# EAGLE design Controller Board (EAGLE 9.6.2)
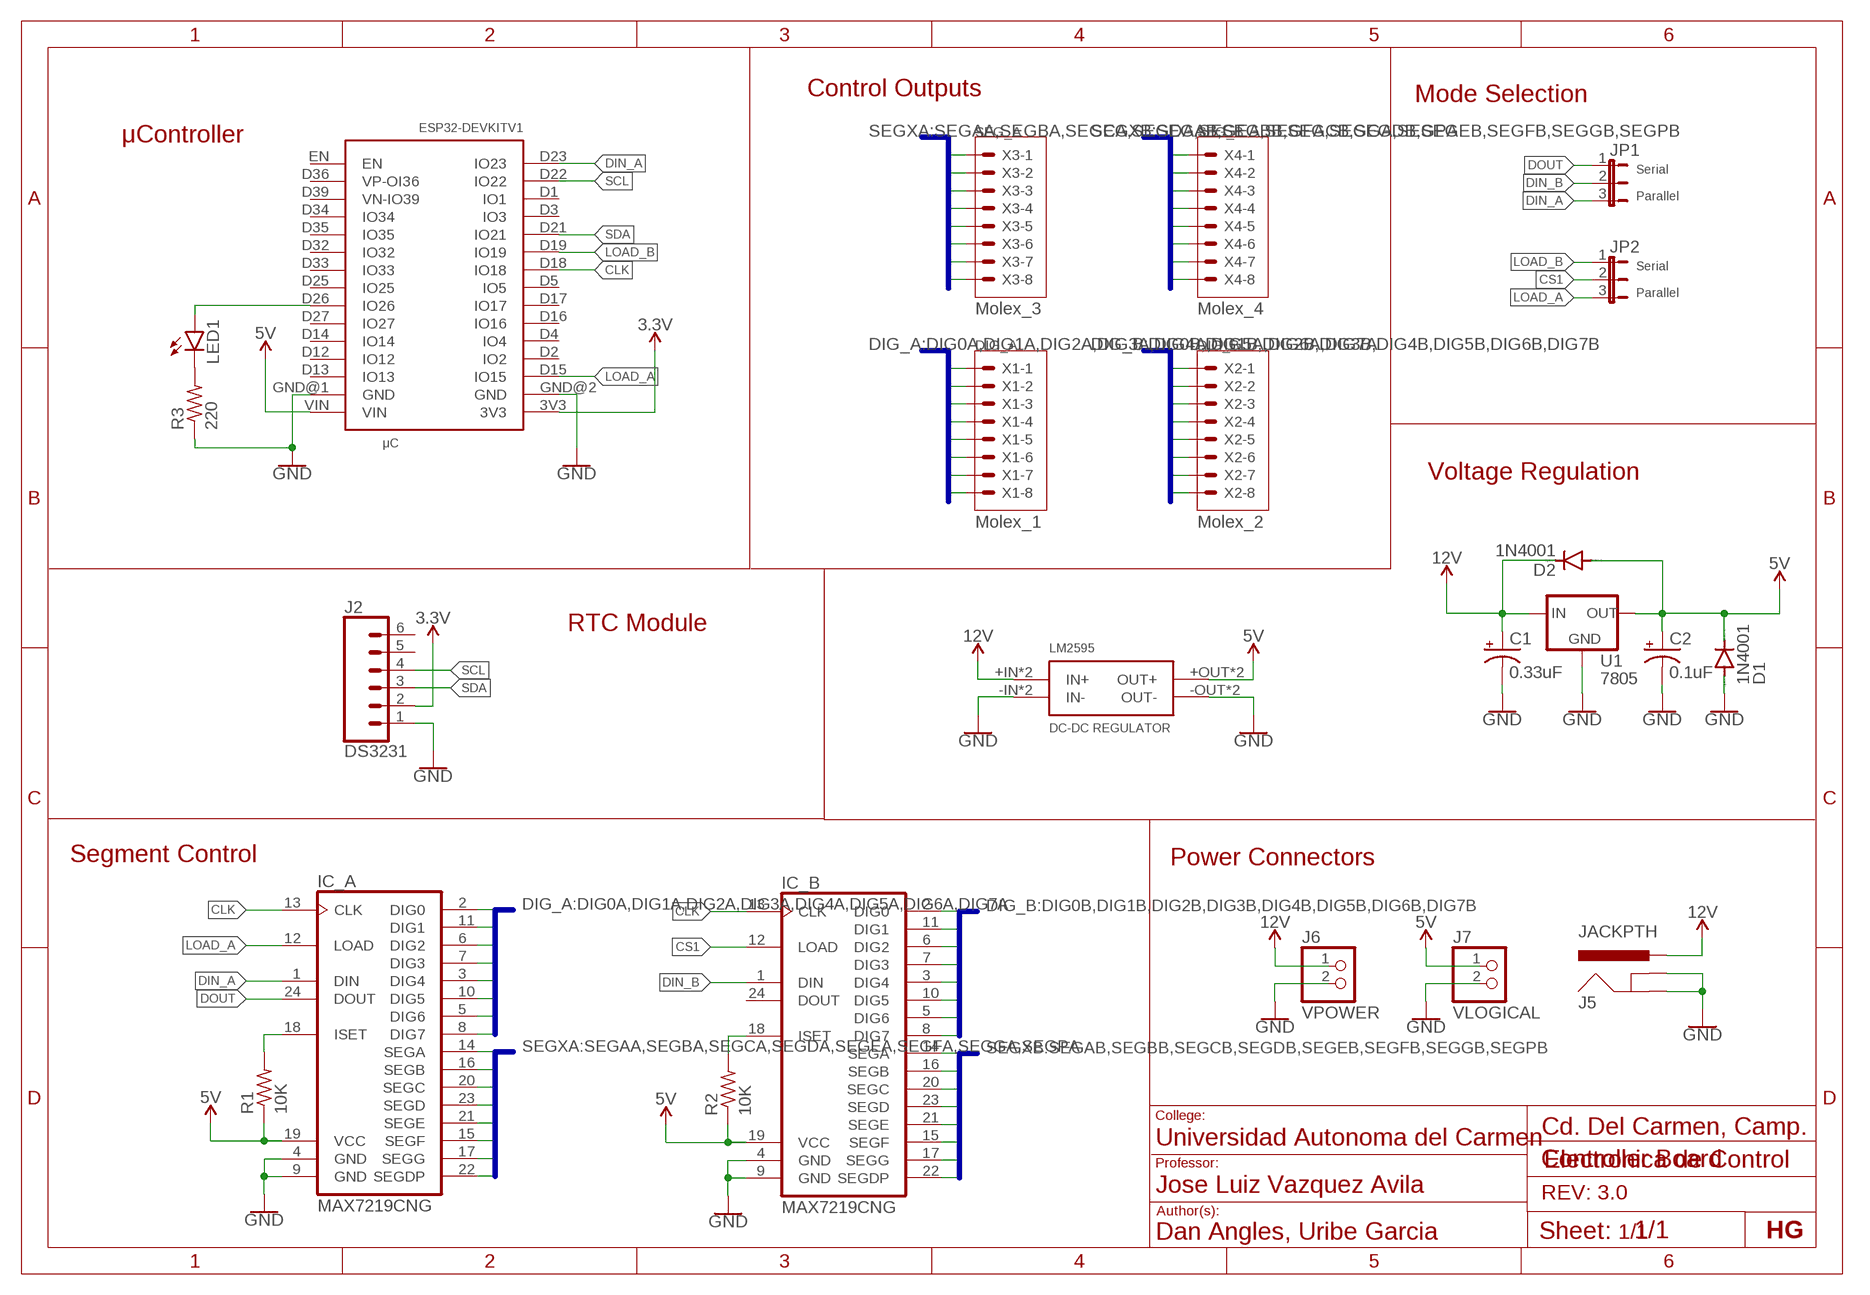
[diagram p0: schematic, sheet 1]

## Parts
C1  0.33uF  CPOL-USE3.5-8  [E3,5-8]
C2  0.1uF  CPOL-USE2-5  [E2-5]
D1  1N4001  1N4004  [DO41-10]
D2  1N4001  1N4004  [DO41-10]
IC_A  MAX7219CNG  [DIL24-3]
IC_B  MAX7219CNG  [DIL24-3]
J2  DS3231  CONN_06FEMALE_LOCK  [1X06_FEMALE_LOCK.010]
J5  JACKPTH  POWER_JACKPTH_LOCK  [POWER_JACK_PTH_LOCK]
J6  VPOWER  PINHD-1X2  [1X02]
J7  VLOGICAL  PINHD-1X2  [1X02]
JP1  JP2E  [JP2]
JP2  JP2E  [JP2]
LED1  LEDCHIP-LED0805  [CHIP-LED0805]
R1  10K  R-US_0204/7  [0204/7]
R2  10K  R-US_0204/7  [0204/7]
R3  220  R-US_R0805  [R0805]
U1  7805  V_REG_78XXSIDE  [78XXL]
U$1  MODULE_LM2595  [MODULE_LM2595]
X1  KK-156-8  [KK-156-8]
X2  KK-156-8  [KK-156-8]
X3  KK-156-8  [KK-156-8]
X4  KK-156-8  [KK-156-8]
μC  ESP32DEVKITV1  [ESP32-DEVKITV1]

## Nets
3.3V: J2.2 μC.3V3
5V: C2.+ D1.C D2.A IC_A.19(VCC) IC_B.19(VCC) J7.1 R1.1 R2.1 U1.OUT U$1.+OUT(OUT+) U$1.+OUTSMD(OUT+) μC.VIN
12V: C1.+ D2.C J5.PWR J6.1 U1.IN U$1.+IN(IN+) U$1.+INSMD(IN+)
CLK: IC_A.13(CLK) IC_B.13(CLK) μC.D18(IO18)
CS1: IC_B.12(LOAD) JP2.2
DIG0A: IC_A.2(DIG0) X1.1
DIG0B: IC_B.2(DIG0) X2.1
DIG1A: IC_A.11(DIG1) X1.2
DIG1B: IC_B.11(DIG1) X2.2
DIG2A: IC_A.6(DIG2) X1.3
DIG2B: IC_B.6(DIG2) X2.3
DIG3A: IC_A.7(DIG3) X1.4
DIG3B: IC_B.7(DIG3) X2.4
DIG4A: IC_A.3(DIG4) X1.5
DIG4B: IC_B.3(DIG4) X2.5
DIG5A: IC_A.10(DIG5) X1.6
DIG5B: IC_B.10(DIG5) X2.6
DIG6A: IC_A.5(DIG6) X1.7
DIG6B: IC_B.5(DIG6) X2.7
DIG7A: IC_A.8(DIG7) X1.8
DIG7B: IC_B.8(DIG7) X2.8
DIN_A: IC_A.1(DIN) JP1.3 μC.D23(IO23)
DIN_B: IC_B.1(DIN) JP1.2
DOUT: IC_A.24(DOUT) JP1.1
GND [New Class]: C1.- C2.- D1.A IC_A.4(GND) IC_A.9(GND) IC_B.4(GND) IC_B.9(GND) J2.1 J5.GND J5.GNDBREAK J6.2 J7.2 R3.1 U1.GND U$1.-IN(IN-) U$1.-INSMD(IN-) U$1.-OUT(OUT-) U$1.-OUTSMD(OUT-) μC.GND@1(GND) μC.GND@2(GND)
ISET-A: IC_A.18(ISET) R1.2
ISET-B: IC_B.18(ISET) R2.2
LOAD_A: IC_A.12(LOAD) JP2.3 μC.D15(IO15)
LOAD_B: JP2.1 μC.D19(IO19)
N$1: LED1.A μC.D26(IO26)
N$2: LED1.C R3.2
SCL: J2.4 μC.D22(IO22)
SDA: J2.3 μC.D21(IO21)
SEGAA: IC_A.14(SEGA) X3.1
SEGAB: IC_B.14(SEGA) X4.1
SEGBA: IC_A.16(SEGB) X3.2
SEGBB: IC_B.16(SEGB) X4.2
SEGCA: IC_A.20(SEGC) X3.3
SEGCB: IC_B.20(SEGC) X4.3
SEGDA: IC_A.23(SEGD) X3.4
SEGDB: IC_B.23(SEGD) X4.4
SEGEA: IC_A.21(SEGE) X3.5
SEGEB: IC_B.21(SEGE) X4.5
SEGFA: IC_A.15(SEGF) X3.6
SEGFB: IC_B.15(SEGF) X4.6
SEGGA: IC_A.17(SEGG) X3.7
SEGGB: IC_B.17(SEGG) X4.7
SEGPA: IC_A.22(SEGDP) X3.8
SEGPB: IC_B.22(SEGDP) X4.8
Unconnected: IC_B.24(DOUT) J2.5 J2.6 μC.D1(IO1) μC.D2(IO2) μC.D3(IO3) μC.D4(IO4) μC.D5(IO5) μC.D12(IO12) μC.D13(IO13) μC.D14(IO14) μC.D16(IO16) μC.D17(IO17) μC.D25(IO25) μC.D27(IO27) μC.D32(IO32) μC.D33(IO33) μC.D34(IO34) μC.D35(IO35) μC.D36(VP-OI36) μC.D39(VN-IO39) μC.EN

## Buses
DIG_A:DIG0A,DIG1A,DIG2A,DIG3A,DIG4A,DIG5A,DIG6A,DIG7A
SEGXA:SEGAA,SEGBA,SEGCA,SEGDA,SEGEA,SEGFA,SEGGA,SEGPA
DIG_B:DIG0B,DIG1B,DIG2B,DIG3B,DIG4B,DIG5B,DIG6B,DIG7B
SEGXB:SEGAB,SEGBB,SEGCB,SEGDB,SEGEB,SEGFB,SEGGB,SEGPB

## Notes on the sheet
- Control Outputs | Mode Selection
- SEG_A | SEG_B
- μController
- Serial
- Parallel
- Serial
- Parallel
- Molex_3 | Molex_4
- DIG_A | DIG_B
- Voltage Regulation
- Molex_1 | Molex_2
- RTC Module
- Segment Control | Power Connectors
- College:
- Cd. Del Carmen, Camp.
- Universidad Autonoma del Carmen
- Professor: | Electronica de Control
- Jose Luiz Vazquez Avila
- REV: 3.0
- Author(s):
- Dan Angles, Uribe Garcia | 1/1 | HG

## Library data of the parts
C1 C2 = rcl:CPOL-US: POLARIZED CAPACITOR, American symbol; SPICEPREFIX: C
D1 D2 = diode:1N4004: DIODE general purpose rectifier, 1 A
IC_A IC_B = maxim:MAX7219CNG: LED DISPLAY DRIVER; MF: MAXIM; MPN: MAX7219CNG; OC_FARNELL: 1523914; OC_NEWARK: 34C4018
J2 = SparkFun-Connectors:CONN_06: Multi connection point. Often used as Generic Header-pin footprint for 0.1 inch spaced/style header connections On any of the 0.1 inch spaced packages, you can populate with these: Break Away Headers - Straight <https://www.sparkfun.com/products/116> (PRT-00116) Break Away Male Headers - Right Angle <https://www.sparkfun.com/products/553> (PRT-00553) Female Headers <https://www.sparkfun.com/products/115> (PRT-00115) Break Away Headers - Machine Pin <https://www.sparkfun.com/products/117> (PRT-00117) Break Away Female Headers - Swiss Machine Pin <https://www.sparkfun.com/products/743> (PRT-00743) Arduino Stackable Header - 6 Pin <https://www.sparkfun.com/products/9280> (PRT-09280) For SCREWTERMINALS and SPRING TERMINALS visit here: Screw Terimnals on SparkFun.com <https://www.sparkfun.com/search/results?term=Screw+Terminals> (5mm/3.5mm/2.54mm spacing) This device is also useful as a general connection point to wire up your design to another part of your project. Our various solder wires solder well into these plated through hole pads. Hook-Up Wire - Assortment (Stranded, 22 AWG) <https://www.sparkfun.com/products/11375> (PRT-11375) Hook-Up Wire - Assortment (Solid Core, 22 AWG) <https://www.sparkfun.com/products/11367> (PRT-11367) View the entire wire category on our website here <https://www.sparkfun.com/categories/141>
J5 = SparkFun-Connectors:POWER_JACK: Power Jack Connector This is the standard 5.5mm barrel jack for power. The PTH is the most common, proven, reliable, footprint. The Slot footprint only works if the mill layer is transmitted to the PCB fab house so be warned. Here are the connectors we sell at SparkFun: DC Barrel Power Jack/Connector <https://www.sparkfun.com/products/119> (PRT-00119) DC Barrel Power Jack/Connector (SMD) <https://www.sparkfun.com/products/12748> (PRT-12748) DC Barrel Jack Adapter - Breadboard Compatible <https://www.sparkfun.com/products/10811> (PRT-10811) It is used on this SparkFun product (and many, many others): SparkFun RedBoard - Programmed with Arduino <https://www.sparkfun.com/products/12757> (DEV-12757) Also, if you need a mating power supply or connector, please check these out: Wall Adapter Power Supply - 9VDC 650mA <https://www.sparkfun.com/products/298> (TOL-00298) DC Barrel Jack Adapter - Male <https://www.sparkfun.com/products/10287> (PRT-10287); PROD_ID: CONN-08197; SF_ID: PRT-00119
J6 J7 = pinhead:PINHD-1X2: PIN HEADER
JP1 JP2 = jumper:JP2E: JUMPER
LED1 = led:LED: LED OSRAM: - CHIPLED LG R971, LG N971, LY N971, LG Q971, LY Q971, LO R971, LY R971 LH N974, LH R974 LS Q976, LO Q976, LY Q976 LO Q996 - Hyper CHIPLED LW Q18S LB Q993, LB Q99A, LB R99A - SideLED LS A670, LO A670, LY A670, LG A670, LP A670 LB A673, LV A673, LT A673, LW A673 LH A674 LY A675 LS A676, LA A676, LO A676, LY A676, LW A676 LS A679, LY A679, LG A679 - Hyper Micro SIDELED® LS Y876, LA Y876, LO Y876, LY Y876 LT Y87S - SmartLED LW L88C, LW L88S LB L89C, LB L89S, LG L890 LS L89K, LO L89K, LY L89K LS L896, LA L896, LO L896, LY L896 - TOPLED LS T670, LO T670, LY T670, LG T670, LP T670 LSG T670, LSP T670, LSY T670, LOP T670, LYG T670 LG T671, LOG T671, LSG T671 LB T673, LV T673, LT T673, LW T673 LH T674 LS T676, LA T676, LO T676, LY T676, LB T676, LH T676, LSB T676, LW T676 LB T67C, LV T67C, LT T67C, LS T67K, LO T67K, LY T67K, LW E67C LS E67B, LA E67B, LO E67B, LY E67B, LB E67C, LV E67C, LT E67C LW T67C LS T679, LY T679, LG T679 LS T770, LO T770, LY T770, LG T770, LP T770 LB T773, LV T773, LT T773, LW T773 LH T774 LS E675, LA E675, LY E675, LS T675 LS T776, LA T776, LO T776, LY T776, LB T776 LHGB T686 LT T68C, LB T68C - Hyper Mini TOPLED® LB M676 - Mini TOPLED Santana® LG M470 LS M47K, LO M47K, LY M47K Source: http://www.osram.convergy.de LUXEON: - LUMILED® LXK2-PW12-R00, LXK2-PW12-S00, LXK2-PW14-U00, LXK2-PW14-V00 LXK2-PM12-R00, LXK2-PM12-S00, LXK2-PM14-U00 LXK2-PE12-Q00, LXK2-PE12-R00, LXK2-PE12-S00, LXK2-PE14-T00, LXK2-PE14-U00 LXK2-PB12-K00, LXK2-PB12-L00, LXK2-PB12-M00, LXK2-PB14-N00, LXK2-PB14-P00, LXK2-PB14-Q00 LXK2-PR12-L00, LXK2-PR12-M00, LXK2-PR14-Q00, LXK2-PR14-R00 LXK2-PD12-Q00, LXK2-PD12-R00, LXK2-PD12-S00 LXK2-PH12-R00, LXK2-PH12-S00 LXK2-PL12-P00, LXK2-PL12-Q00, LXK2-PL12-R00 Source: www.luxeon.com KINGBRIGHT: KA-3528ASYC Source: www.kingbright.com
R1-R3 = rcl:R-US_: RESISTOR, American symbol; SPICEPREFIX: R
U1 = SparkFun-IC-Power:V_REG_78XX: Voltage Regulator Standard 78xx regulator. IGO (Input Ground Output). Spark Fun Electronics SKU : COM-00107
U$1 = MODULE_LM2595:MODULE_LM2595
X1-X4 = con-molex:KK-156-8: KK 156 HEADER Source: http://www.molex.com/pdm_docs/sd/026604100_sd.pdf; MF: MOLEX; OC_FARNELL: unknown; OC_NEWARK: unknown
μC = ESP32-DEVKITV1:ESP32DEVKITV1

## Board
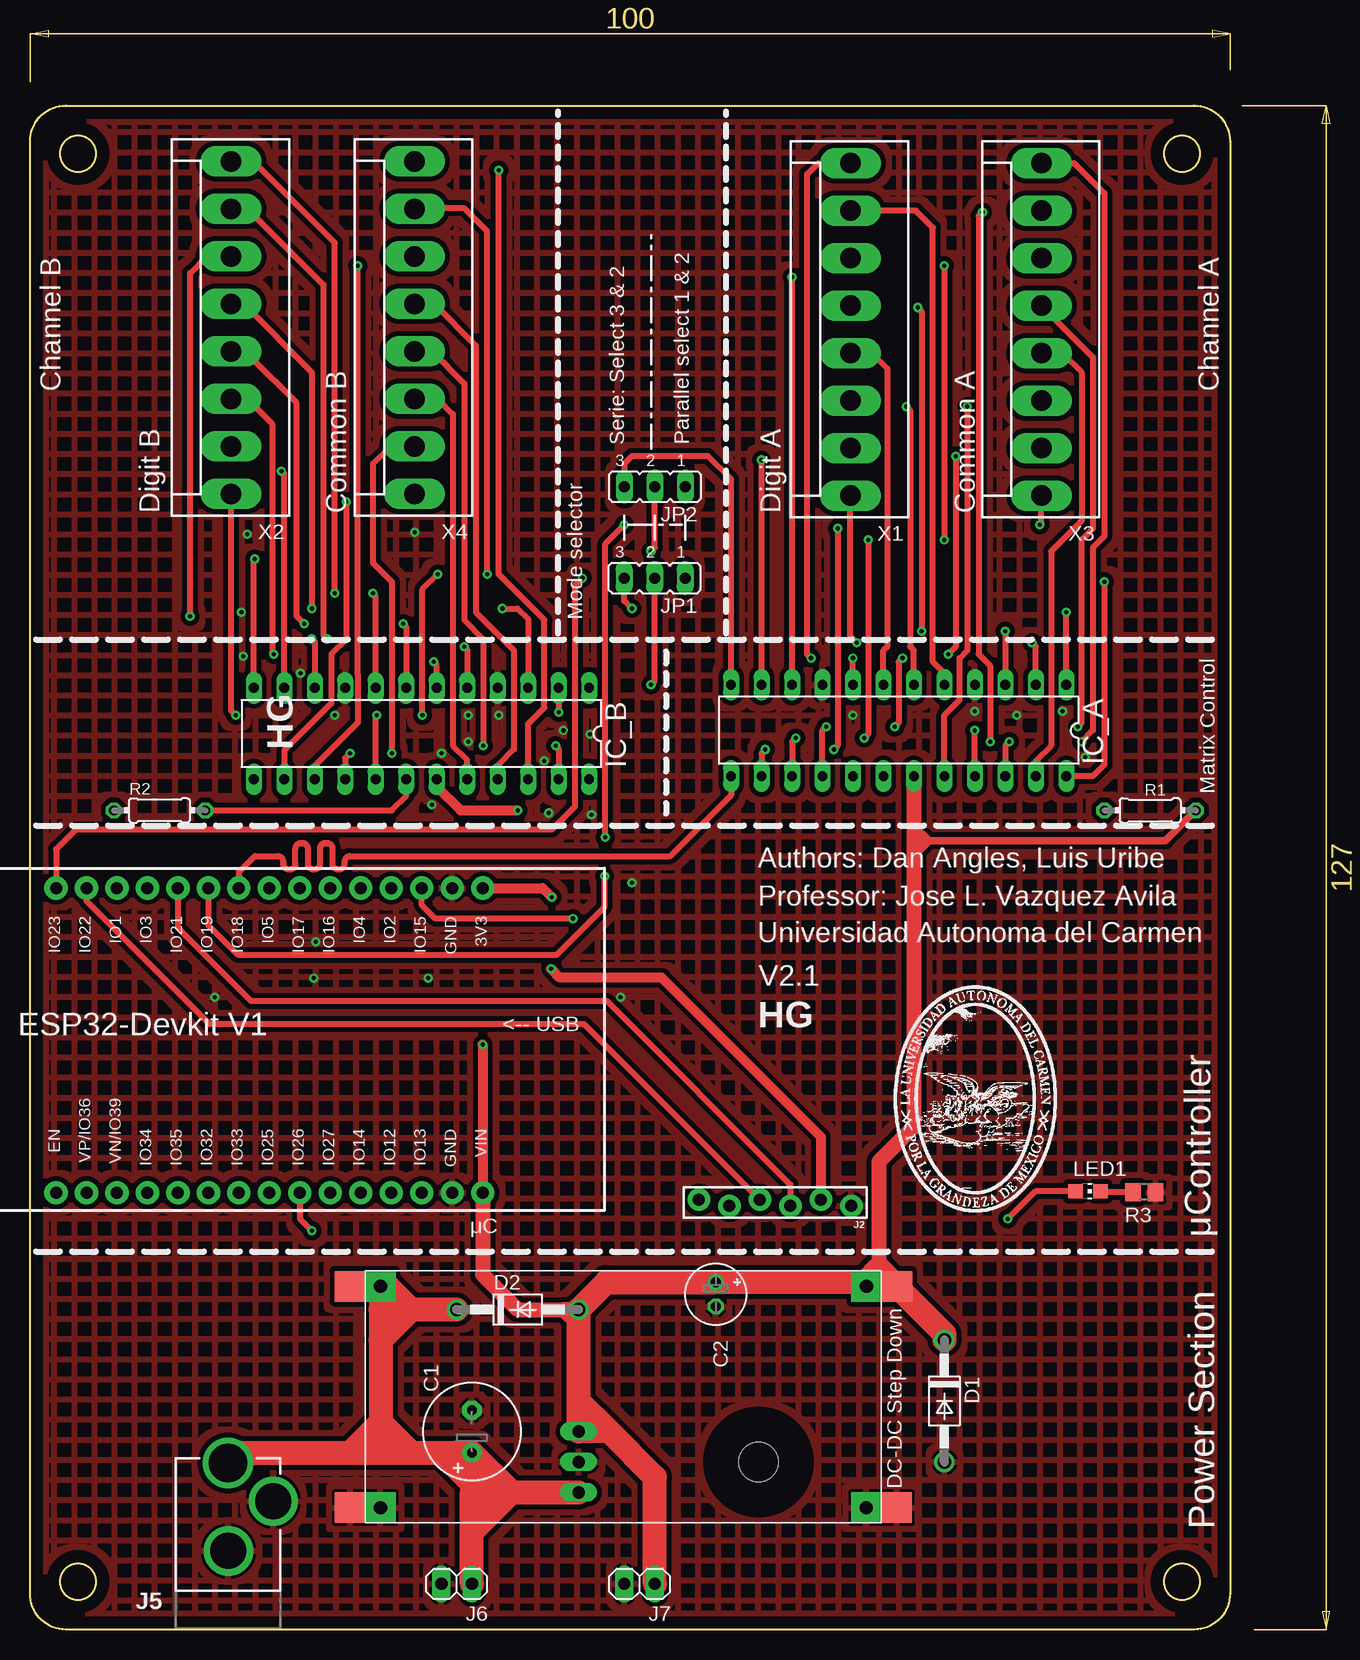
[diagram p1: board, top side]
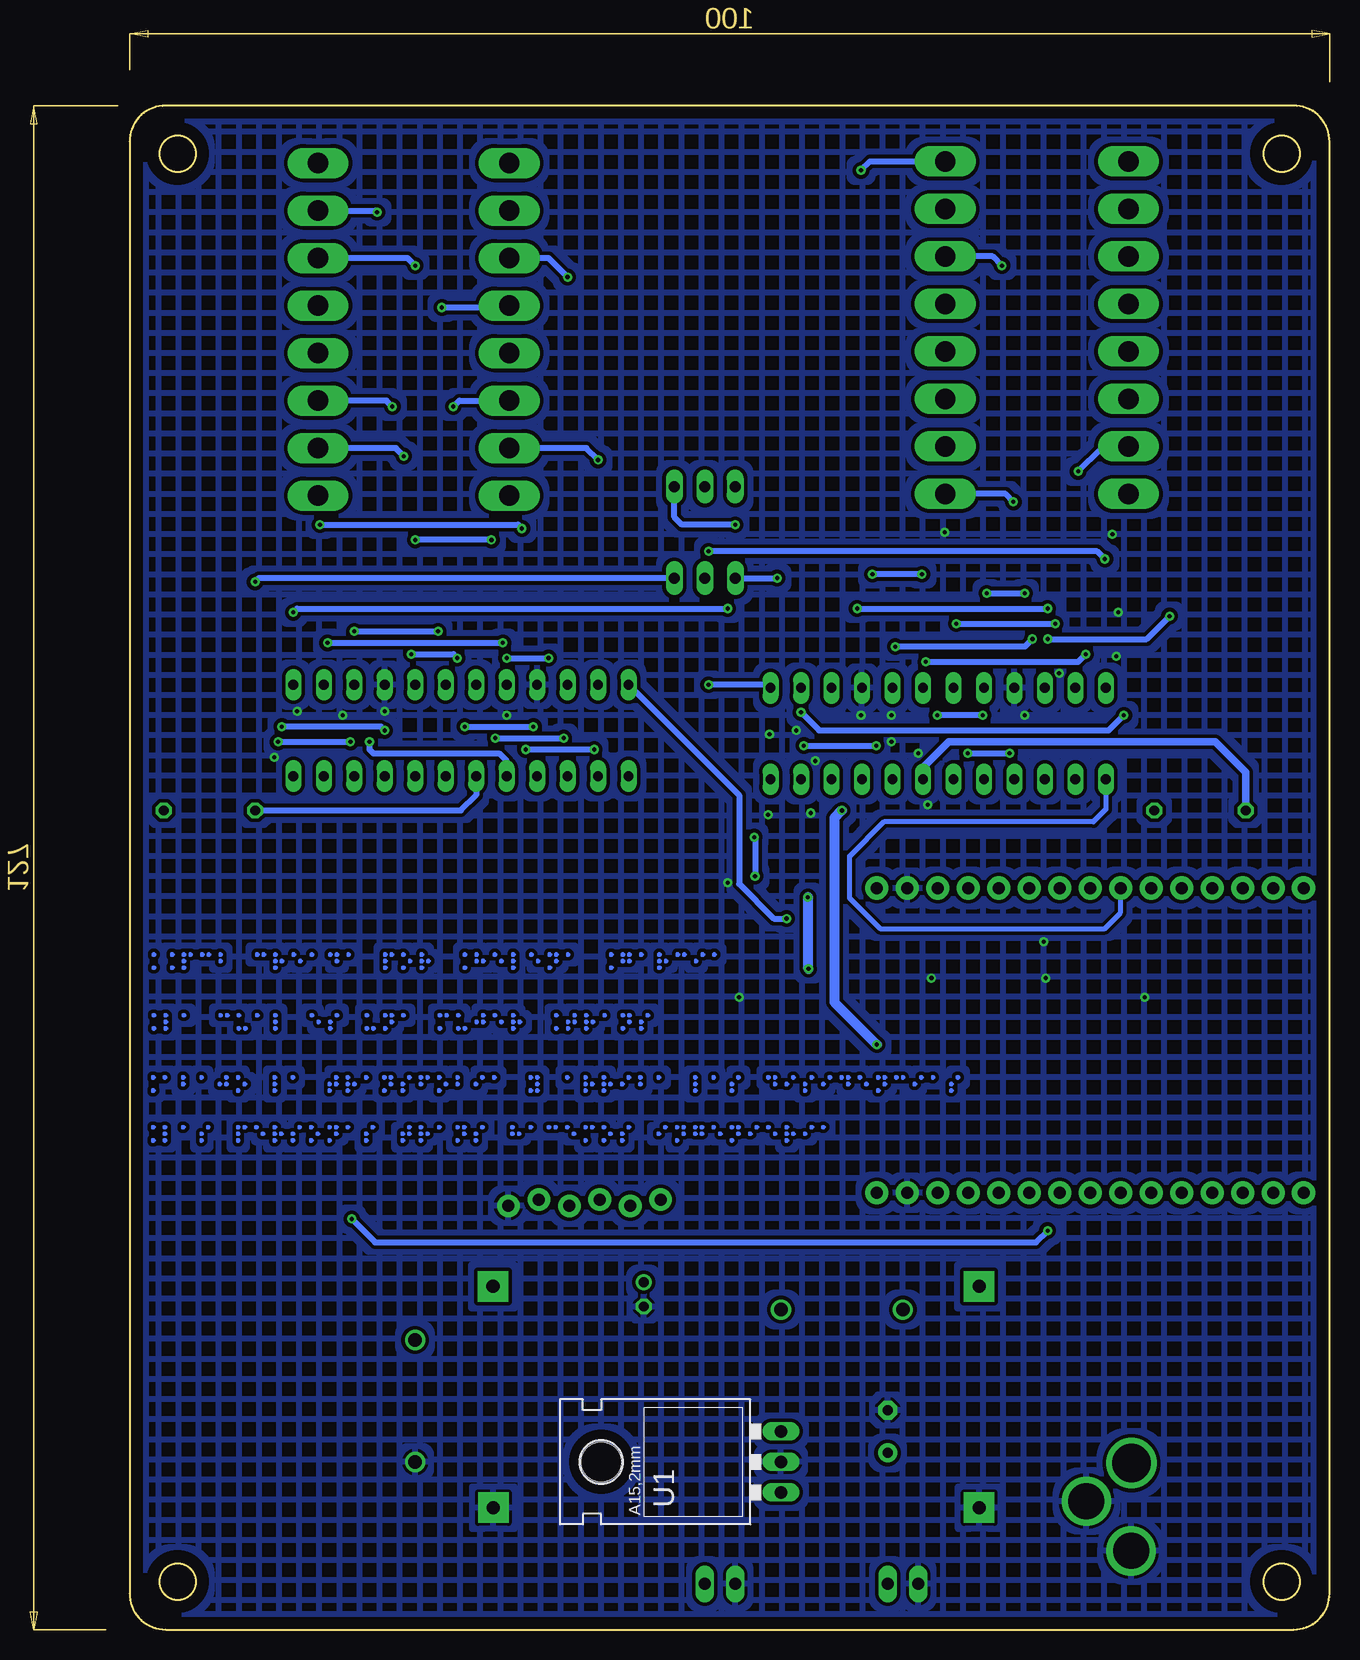
[diagram p2: board, bottom side, seen from below]

Size 100 x 127 mm. Coordinates in mm from the lower left corner, seen from the top.
Outline: 97,0 3,0 arc-90 0,3 0,124 arc-90 3,127 97,127 arc-90 100,124 100,3 arc-90 97,0
Outline: circle at 4,123 radius 1.5
Outline: circle at 96,123 radius 1.5
Outline: circle at 96,4 radius 1.5
Outline: circle at 4,4 radius 1.5
Copper layers (1*16): Top 0.035mm / dielectric 1.5mm / Bottom 0.035mm
Design rules "default": minimum track width 6mil, minimum drill 0.35mm, track to track 6mil, track to pad 6mil, pad to pad 6mil, via to via 6mil, smd to smd 6mil, copper to edge 40mil, drill to drill 6mil, minimum pad ring 10mil, minimum via ring 8mil, stop-mask expansion 4mil, vias tented up to drill 0mil, thermal gap 10mil

### Footprints (pad centres in the part's own frame; a part is rotated, then mirrored left to right if it is on the bottom)
E3,5-8 = drill 0.813 pad 1.6: + -1.778,0 | drill 0.813 pad 1.6 octagon: - 1.778,0
E2-5 = drill 0.813 pad 1.27: + -1.016,0 | drill 0.813 pad 1.27 octagon: - 1.016,0
DO41-10 = drill 1.118: A 5.08,0; C -5.08,0
DIL24-3 = drill 0.813 long: 1 -13.97,-3.81; 2 -11.43,-3.81; 3 -8.89,-3.81; 4 -6.35,-3.81; 5 -3.81,-3.81; 6 -1.27,-3.81; 7 1.27,-3.81; 8 3.81,-3.81; 9 6.35,-3.81; 10 8.89,-3.81; 11 11.43,-3.81; 12 13.97,-3.81; 13 13.97,3.81; 14 11.43,3.81; 15 8.89,3.81; 16 6.35,3.81; 17 3.81,3.81; 18 1.27,3.81; 19 -1.27,3.81; 20 -3.81,3.81; 21 -6.35,3.81; 22 -8.89,3.81; 23 -11.43,3.81; 24 -13.97,3.81
1X06_FEMALE_LOCK.010 = drill 1.016 pad 1.88: 1 0,0.254; 2 2.54,-0.254; 3 5.08,0.254; 4 7.62,-0.254; 5 10.16,0.254; 6 12.7,-0.254
POWER_JACK_PTH_LOCK = drill 2.997 pad 4.115: GND 0.025,6.557; GNDBREAK 3.762,10.7 | drill 3.2 pad 4.115: PWR 0,13.878
1X02 = drill 1.016 long: 1 -1.27,0; 2 1.27,0
JP2 = drill 0.914 long: 1 -2.54,0; 2 0,0; 3 2.54,0
CHIP-LED0805 = smd 1.2 x 1.2: A 0,-1.05; C 0,1.05
0204/7 = drill 0.813 octagon: 1 -3.81,0; 2 3.81,0
R0805 = smd 1.3 x 1.5: 1 -0.95,0; 2 0.95,0
78XXL = drill 1.016 long: GND 0,-3.81; IN -2.54,-3.81; OUT 2.54,-3.81 | hole 3.302: 0,11.176
MODULE_LM2595 = drill 1.1 pad 2.54 square: +IN 1.26,19.72; +OUTSMD 41.77,19.72; -IN 1.26,1.27; -OUTSMD 41.75,1.27 | smd 2.54 x 2.54: +INSMD -1.28,19.72; +OUT 44.3,19.72; -INSMD -1.27,1.27; -OUT 44.28,1.27
KK-156-8 = drill 1.7 pad 2.184 long: 1 -13.86,0; 2 -9.9,0; 3 -5.94,0; 4 -1.98,0; 5 1.98,0; 6 5.94,0; 7 9.9,0; 8 13.86,0
ESP32-DEVKITV1 = drill 1 pad 1.93: 3V3 -16.52,-12.27; D1 13.96,-12.27; D2 -8.9,-12.27; D3 11.42,-12.27; D4 -6.36,-12.27; D5 1.26,-12.27; D12 -8.9,13.135; D13 -11.44,13.135; D14 -6.36,13.135; D15 -11.44,-12.27; D16 -3.82,-12.27; D17 -1.28,-12.27; D18 3.8,-12.27; D19 6.34,-12.27; D21 8.88,-12.27; D22 16.5,-12.27; D23 19.04,-12.27; D25 1.26,13.135; D26 -1.28,13.135; D27 -3.82,13.135; D32 6.34,13.135; D33 3.8,13.135; D34 11.42,13.135; D35 8.88,13.135; D36 16.5,13.135; D39 13.96,13.135; EN 19.04,13.135; GND@1 -13.98,13.135; GND@2 -13.98,-12.27; VIN -16.52,13.135

### Placement (x,y rotation side)
C1  36.83,16.51 90 top
C2  57.15,27.94 270 top
D1  76.2,19.05 270 top
D2  40.64,26.67 0 top
IC_A  72.39,74.93 180 top
IC_B  32.62,74.67 180 top
J2  68.44,35.57 180 top
J5  16.51,0 0 top
J6  35.56,3.81 180 top
J7  50.8,3.81 180 top
JP1  52.06,87.63 180 top
JP2  52.07,95.25 180 top
LED1  88.16,36.53 270 top
R1  93.34,68.26 180 top
R2  10.8,68.26 0 top
R3  92.85,36.46 180 top
U1  49.53,13.97 90 bottom
U$1  27.94,8.89 0 top
X1  68.37,108.36 90 top
X2  16.76,108.5 90 top
X3  84.28,108.36 90 top
X4  32.03,108.5 90 top
μC  21.21,49.53 180 top

### Tracks (layer width: path | path; a pad name or v marks a point on that pad's centre or on a via)
3.3V  (via drill 0.35)
  Top 0.813: μC.3V3 42.72,61.8 v43.49,61.04 | v43.42,55.06 44.16,54.33 52.63,54.33 65.9,41.06 J2.2
  Bottom 0.813: v43.49,61.04 43.49,55.13 v43.42,55.06
5V  (via drill 0.35)
  Top 0.61: 73.66,65.72 74.93,65.72 | 74.93,65.72 94.62,65.72 R1.1 | 73.66,66.99 74.93,65.72 | 74.93,65.72 73.66,64.45
  Top 0.813: IC_B.19 33.89,70.25 35.88,68.26 v40.64,68.26 | v37.73,48.75 μC.VIN
  Top 1.27: 69.85,29.21 70.75,30.11 70.75,39 73.66,41.91 73.66,64.45 73.66,65.72 73.66,66.99 IC_A.19 | D2.A 44.45,26.67 | 44.45,26.67 40.64,26.67 37.73,29.58 μC.VIN | 45.72,25.4 44.45,26.67
  Top 2: U$1.+OUTSMD U$1.+OUT | 45.72,19.05 U1.OUT 48.26,16.51 | 45.72,19.05 45.72,25.4 D2.A 48.01,28.96 C2.+ 69.36,28.96 U$1.+OUTSMD | J7.1 52.07,12.7 48.26,16.51 | 48.26,16.51 45.72,19.05 | U$1.+OUT 76.2,24.65 D1.C | U$1.+OUT 70.75,30.11 69.71,29.07 U$1.+OUTSMD
  Bottom 0.61: IC_B.19 33.89,71.84 31.75,73.98 9.52,73.98 6.98,71.44 R2.1
  Bottom 0.813: v40.64,68.26 41.27,67.63 41.27,52.3 v37.73,48.75
12V
  Top 2: J5.PWR 17.36,14.73 26.67,14.73 | 26.67,14.73 29.21,14.73 | 29.21,14.73 31.75,14.73 | 31.75,14.73 34.29,14.73 | 34.29,14.73 35.56,14.73 | 35.56,14.73 C1.+ | U$1.+IN 29.21,28.6 29.21,26.67 | 29.21,26.67 29.21,24.13 | 29.21,24.13 29.21,17.27 | 29.21,17.27 29.21,14.73 | 26.67,14.73 29.21,17.27 | 29.21,17.27 31.75,14.73 | U$1.+INSMD U$1.+IN | D2.C 31.75,26.67 | 31.75,26.67 29.21,26.67 | U$1.+IN 29.81,28.61 31.75,26.67 | 29.21,24.13 31.75,26.67 | J6.1 36.83,8.13 | 36.83,8.13 36.83,11.43 | 36.83,12.19 36.83,13.46 | 36.83,13.46 C1.+ | 35.56,14.73 36.83,13.46 | 36.83,11.43 40.13,11.43 | 40.13,11.43 U1.IN | 40.13,11.43 C1.+ | 36.83,8.13 40.13,11.43 | 34.29,14.73 36.83,12.19 | 36.83,12.19 36.83,11.43
CLK
  Top 0.508: IC_A.13 58.42,69.53 53.34,64.45 26.67,64.45 arc90 26.23,64.01 26.23,63.8 arc-90 25.78,63.36 25.65,63.36 arc-90 25.2,63.8 25.2,65.1 arc90 24.76,65.55 24.62,65.55 arc90 24.18,65.1 24.18,63.8 arc-90 23.73,63.36 23.59,63.36 arc-90 23.15,63.8 23.15,65.1 arc90 22.71,65.55 22.57,65.55 arc90 22.12,65.1 22.12,63.8 arc-90 21.68,63.36 21.54,63.36 arc-90 21.1,63.8 21.1,64.01 arc90 20.65,64.45 18.73,64.45 17.41,63.13 μC.D18
  Bottom 0.406: 18.65,69.59 IC_B.13 18.65,68.35 19.68,67.31 37.15,67.31 40.01,64.45 40.01,60.96 37.46,58.42 18.73,58.42 17.41,59.74 μC.D18 17.41,62.6
CS1  (via drill 0.35)
  Top 0.508: IC_B.12 18.65,89.13 v18.73,89.22 | v51.75,89.85 52.07,90.17 JP2.2
  Bottom 0.508: v18.73,89.22 19.37,89.85 v51.75,89.85
DIG0A  (via drill 0.35)
  Top 0.508: IC_A.2 83.82,81.91 v83.5,82.23 | v68.9,82.23 68.37,82.77 X1.1
  Bottom 0.508: v83.5,82.23 v68.9,82.23
DIG0B  (via drill 0.35)
  Top 0.508: IC_B.2 v44.05,76.44 | v17.15,76.2 16.76,76.58 X2.1
  Bottom 0.508: v44.05,76.44 42.55,74.93 18.41,74.93 v17.15,76.2
DIG1A  (via drill 0.35)
  Top 0.508: IC_A.11 v60.96,97.47
  Bottom 0.508: v60.96,97.47 61.94,98.45 X1.2
DIG1B  (via drill 0.35)
  Top 0.508: IC_B.11 21.19,96.29 v20.96,96.52
  Bottom 0.508: v20.96,96.52 19.05,98.43 16.76,98.43 X2.2
DIG2A  (via drill 0.35)
  Top 0.508: v73.03,101.92 73.34,101.6 73.34,81.91 73.66,81.6 IC_A.6
  Bottom 0.508: v73.03,101.92 72.53,102.41 X1.3
DIG2B  (via drill 0.35)
  Top 0.508: IC_B.6 33.89,80.41 v33.66,80.65 | X2.3 18.1,102.55 20.17,100.48 20.17,81.43 v20.32,81.28
  Bottom 0.508: v33.66,80.65 20.96,80.65 v20.32,81.28
DIG3A
  Top 0.508: X1.4 70.16,106.38 71.44,105.09 71.44,81.91 71.12,81.6 IC_A.7
DIG3B  (via drill 0.35)
  Top 0.508: X2.4 17.23,106.05 18.41,106.05 22.23,102.23 22.23,84.45 v22.86,83.82 | v31.12,83.82 31.35,83.58 IC_B.7
  Bottom 0.508: v31.12,83.82 v22.86,83.82
DIG4A  (via drill 0.35)
  Top 0.508: v73.98,110.17 74.3,109.86 v74.3,83.19 | v81.28,83.19 IC_A.3
  Bottom 0.508: X1.5 68.53,110.17 v73.98,110.17 | v81.28,83.19 v74.3,83.19
DIG4B  (via drill 0.35)
  Top 0.508: X2.5 17.8,110.48 23.49,104.78 v23.49,85.09 | v39.37,85.09 40.64,85.09 41.51,84.22 IC_B.3
  Bottom 0.508: v39.37,85.09 v23.49,85.09
DIG5A  (via drill 0.35)
  Top 0.508: IC_A.10 v63.5,112.71
  Bottom 0.508: X1.6 65.08,114.3 v63.5,112.71
DIG5B  (via drill 0.35)
  Top 0.508: v23.49,82.55 23.73,82.32 IC_B.10 | v13.34,84.45 13.34,113.03 14.74,114.44 X2.6
  Bottom 0.508: v23.49,82.55 15.24,82.55 v13.34,84.45
DIG6A
  Top 0.508: IC_A.5 76.2,79.69 75.25,80.65 75.25,116.84 73.83,118.26 X1.7
DIG6B  (via drill 0.35)
  Top 0.508: X2.7 17.05,118.11 18.41,118.11 24.45,112.08 24.45,82.87 v24.77,82.55 | v36.2,81.91 36.43,81.68 IC_B.5
  Bottom 0.508: v24.77,82.55 25.4,81.91 v36.2,81.91
DIG7A  (via drill 0.35)
  Top 0.508: X1.8 65.7,122.22 64.77,121.28 64.77,81.28 v65.09,80.96 | IC_A.8 v68.58,80.96
  Bottom 0.508: v68.58,80.96 v65.09,80.96
DIG7B  (via drill 0.35)
  Top 0.508: X2.8 18.62,122.35 25.4,115.57 v25.4,86.36 | v28.57,86.36 28.81,86.12 IC_B.8
  Bottom 0.508: v28.57,86.36 v25.4,86.36
DIN_A  (via drill 0.35)
  Top 0.508: v46.04,87.63 45.4,87 45.4,68.58 43.5,66.68 3.81,66.68 2.17,65.03 μC.D23 | IC_A.1 v86.36,84.77 | v50.16,85.09 49.52,85.73 JP1.3
  Bottom 0.508: JP1.3 v46.04,87.63 | v86.36,84.77 86.04,85.09 v50.16,85.09
DIN_B  (via drill 0.35)
  Top 0.508: v51.75,78.74 52.06,79.05 JP1.2
  Bottom 0.508: IC_B.1 46.85,78.74 v51.75,78.74
DOUT  (via drill 0.35)
  Top 0.508: v89.53,87.31 89.53,72.07 88.58,71.12 IC_A.24
  Bottom 0.508: JP1.1 89.22,87.63 v89.53,87.31
GND  (via drill 0.35)
  other vias: 50.16,62.23 25.4,76.2 34.29,73.03 33.5,68.74 36.51,76.2 39.05,76.2 46.79,67.91 32.07,91.44 18.1,91.28 17.62,84.77 22.54,79.69 17.78,81.12 44.45,74.93 42.86,72.39 36.51,73.98 46.67,74.61 68.58,76.2 82.23,76.2 78.74,76.52 87.95,72.71 86.04,76.52 43.24,68.05 23.81,57.31 23.65,54.29 33.18,54.29 15.4,52.71 49.21,52.71
  pour Top (isolate 0.406, hatched): -4,128 104,128 104,-4 -4,-4
  pour Bottom (isolate 0.305, hatched): -8,132 108,132 108,-8 -8,-8
ISET-A
  Bottom 0.508: IC_A.18 71.12,69.53 72.39,68.26 R1.2
ISET-B
  Top 0.508: R2.2 30.16,68.26 31.35,69.45 IC_B.18
LOAD_A  (via drill 0.35)
  Top 0.508: v45.25,59.25 33.78,59.25 32.65,60.38 μC.D15 | IC_A.12 58.42,95.88 56.52,97.79 50.16,97.79 49.53,97.16 JP2.3
  Bottom 0.508: IC_A.12 49.21,69.53 49.21,62.14 46.32,59.25 v45.25,59.25
LOAD_B  (via drill 0.35)
  Top 0.508: v49.53,92.08 47.94,90.49 v47.94,66.04 | v47.88,62.79 47.88,60.24 43.84,56.2 17.36,56.2 14.87,58.69 μC.D19
  Bottom 0.508: v47.94,66.04 47.88,65.98 v47.88,62.79 | v49.53,92.08 53.98,92.08 54.61,92.71 JP2.1
N$1  (via drill 0.35)
  Top 0.508: LED1.A 83.78,36.53 v81.48,34.22 | μC.D26 22.49,34.25 v23.49,33.25
  Bottom 0.508: v23.49,33.25 24.47,32.27 79.53,32.27 v81.48,34.22
N$2
  Top 0.508: R3.2 89.27,36.46 LED1.C
SCL
  Top 0.508: μC.D22 4.71,60.7 14.92,50.48 46.16,50.48 J2.4
SDA
  Top 0.508: μC.D21 12.33,58.47 18.41,52.39 48.05,52.39 63.36,37.08 J2.3
SEGAA  (via drill 0.35)
  Top 0.508: v61.28,73.34 60.96,73.02 IC_A.14 | v84.14,92.08 84.28,92.22 X3.1 | v67.31,91.76 67.31,73.66 v66.99,73.34
  Bottom 0.508: v66.99,73.34 v61.28,73.34 | v84.14,92.08 67.63,92.08 v67.31,91.76
SEGAB  (via drill 0.35)
  Top 0.508: v26.35,93.98 26.35,82.55 25.11,81.31 25.11,77.19 21.19,73.26 IC_B.14
  Bottom 0.508: v26.35,93.98 27.01,94.63 X4.1
SEGBA  (via drill 0.35)
  Top 0.508: IC_A.16 66.04,74.93 v66.36,75.25 | v77.15,97.79 77.15,81.91 v76.52,81.28 | v72.71,80.96 72.39,80.65 72.39,75.57 v72.07,75.25
  Bottom 0.508: v72.07,75.25 v66.36,75.25 | v76.52,81.28 73.03,81.28 v72.71,80.96 | v77.15,97.79 77.82,98.45 X3.2
SEGBB  (via drill 0.35)
  Top 0.508: X4.2 31.86,98.43 29.85,98.43 28.57,97.16 28.57,88.9 30.16,87.31 v30.16,73.02 | v26.67,73.02 26.27,72.63 IC_B.16
  Bottom 0.508: v30.16,73.02 v26.67,73.02
SEGCA  (via drill 0.35)
  Top 0.508: IC_A.20 76.2,76.2 77.47,77.47 77.47,80.96 78.1,81.6 v78.1,101.92
  Bottom 0.508: v78.1,101.92 78.6,102.41 X3.3
SEGCB
  Top 0.508: X4.3 33.97,102.55 35.24,101.28 35.24,73.66 36.43,72.47 IC_B.20
SEGDA
  Top 0.508: X3.4 86.03,106.38 87.63,104.78 87.63,92.39 85.09,89.85 85.09,73.66 83.82,72.39 IC_A.23
SEGDB  (via drill 0.35)
  Top 0.508: X4.4 33.5,106.51 36.2,103.82 36.2,84.14 37.78,82.55 v37.78,73.66 | v43.82,73.66 44.05,73.43 IC_B.23
  Bottom 0.508: v43.82,73.66 v37.78,73.66
SEGEA  (via drill 0.35)
  Top 0.508: IC_A.21 v78.74,74.93 | X3.5 88.58,106.04 88.58,91.76 87.63,90.8 87.63,75.57 v87.31,75.25
  Bottom 0.508: v78.74,74.93 79.06,75.25 v87.31,75.25
SEGEB
  Top 0.508: X4.5 33.67,110.48 37.15,107 37.15,84.77 40.32,81.6 40.32,73.34 38.97,71.99 IC_B.21
SEGFA  (via drill 0.35)
  Top 0.508: v63.82,74.3 63.5,73.98 IC_A.15 | v76.2,113.66 v76.2,90.8 | v69.85,90.8 69.85,74.61 v69.53,74.3
  Bottom 0.508: v69.53,74.3 v63.82,74.3 | v69.85,90.8 v76.2,90.8 | v76.2,113.66 76.83,114.3 X3.6
SEGFB  (via drill 0.35)
  Top 0.508: IC_B.15 23.73,71.99 27.34,75.6 27.34,79.58 27.3,79.61 v27.3,113.66
  Bottom 0.508: v27.3,113.66 28.07,114.44 X4.6
SEGGA  (via drill 0.35)
  Top 0.508: v79.38,118.11 79.06,117.79 79.06,81.28 80.01,80.33 v80.01,73.98
  Bottom 0.508: X3.7 79.52,118.26 v79.38,118.11 | v80.01,73.98 80.01,73.34 79.69,73.02 69.22,73.02 68.58,72.39 IC_A.17
SEGGB  (via drill 0.35)
  Top 0.508: IC_B.17 28.81,76.12 v28.89,76.2 | v32.7,76.2 32.7,86.68 v33.97,87.95 | v38.1,87.95 38.1,116.52 36.2,118.43 32.06,118.43 X4.7
  Bottom 0.508: v28.89,76.2 v32.7,76.2 | v33.97,87.95 v38.1,87.95
SEGPA  (via drill 0.35)
  Top 0.508: X3.8 87.02,122.22 89.53,119.7 89.53,91.12 88.58,90.17 88.58,74.93 v87.63,73.98 | v81.6,73.98 81.28,73.66 IC_A.22
  Bottom 0.508: v87.63,73.98 v81.6,73.98
SEGPB  (via drill 0.35)
  Top 0.508: IC_B.22 41.51,75.48 42.86,76.83 42.86,84.14 39.05,87.95 v39.05,121.6
  Bottom 0.508: v39.05,121.6 38.3,122.35 X4.8
(copper drawn outside any net)
  shapes: Bottom area x1914

### Text on the board
tPlace: Channel B | Channel A | Serie: Select 3 & 2 | Parallel select 1 & 2 | Digit B | Common B | Digit A | Common A | Mode selector | Matrix Control | HG | Authors: Dan Angles, Luis Uribe | Professor: Jose L. Vazquez Avila | Universidad Autonoma del Carmen | V2.1 | <-- USB | HG | μController | Power Section